# Altium schematic sheet InclinometerPower.SchDoc
size 420 x 297 mm; Address1: Address1; Address2: Address2; Address3: Address3; Address4: Address4; DocumentNumber: АБВГ.123456.001 Э3; SheetNumber: 1; Scale: 1:1; DocumentType: Схема электрическая принципиальная; FirstReferrence: АБВГ.123456.001
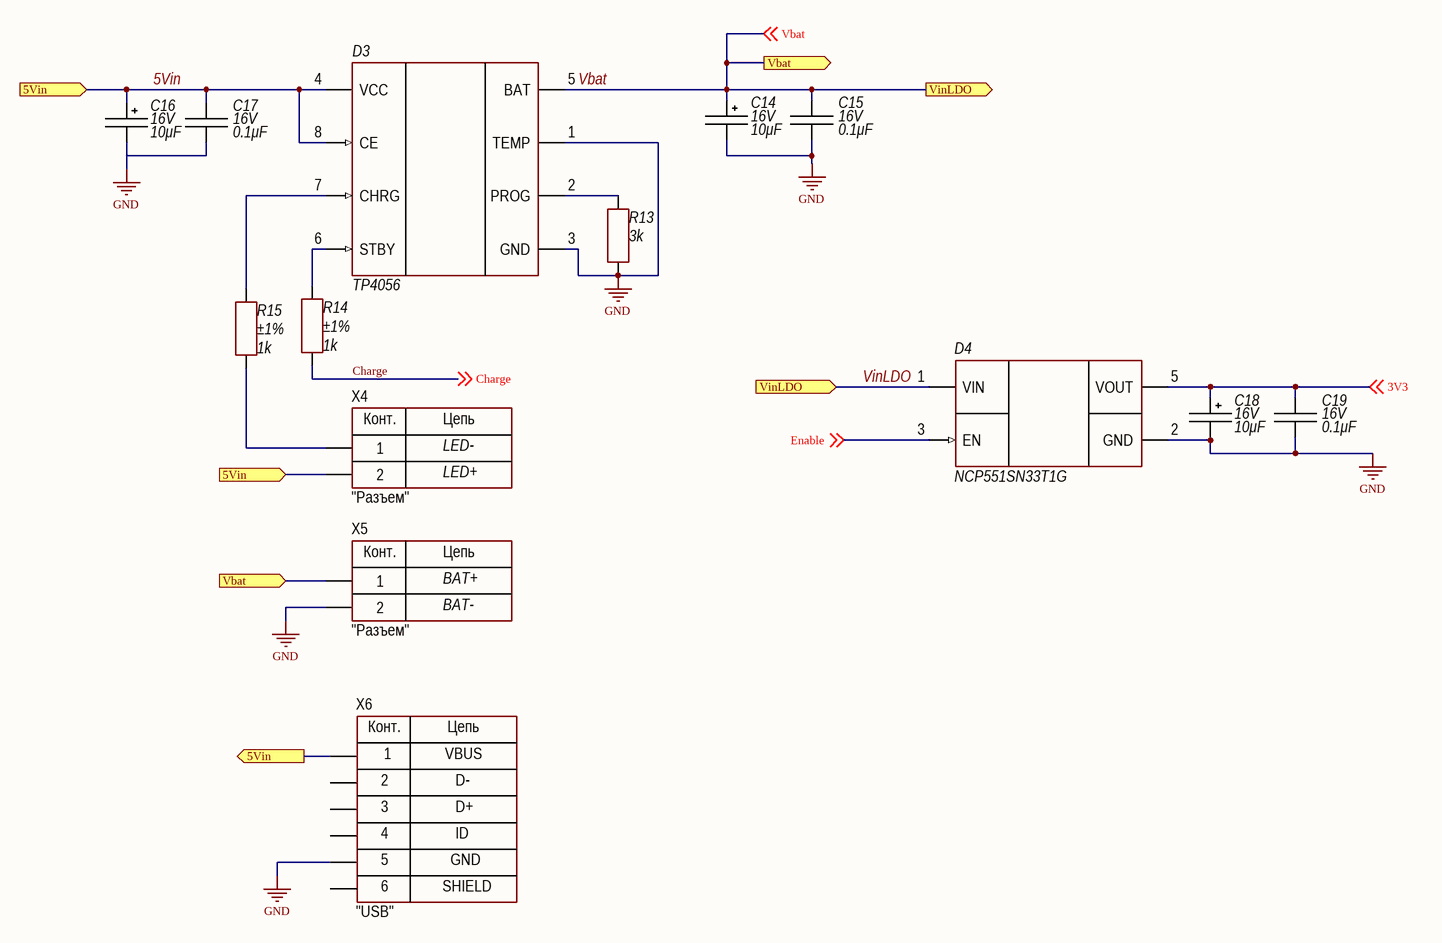
[diagram p0: InclinometerPower.SchDoc]

## Parts
C14  value 10μF  Voltage: 16V  [CAP: TANTAL-A]
C15  value 0.1μF  Voltage: 16V  [CAP: 0603]
C16  value 10μF  Voltage: 16V  [CAP: TANTAL-A]
C17  value 0.1μF  Voltage: 16V  [CAP: 0603]
C18  value 10μF  Voltage: 16V  [CAP: TANTAL-A]
C19  value 0.1μF  Voltage: 16V  [CAP: 0603]
D3  (no value)  [SOP8]
D4  (no value)  [5-TSOP]
R13  value 3k  [RES: 0603]
R14  value 1k  Tolerance: ±1%  [RES: 0603]  (hidden comment: Resistor film, 2k, ±1%, 0603, 0.1W, -55...+155°C)
R15  value 1k  Tolerance: ±1%  [RES: 0603]
X4  CommentText: "Разъем"  [CON: PLS-2]
X5  CommentText: "Разъем"  [CON: PLS-2]
X6  CommentText: "USB"  [CON: USB micro-A (ZX62-B-5PA)]

## Ports
5Vin (in), 5Vin (out), Vbat (in), Vbat (out), VinLDO (in), VinLDO (out)

## Nets
GND: C14.2 C15.1 C16.2 C17.1 C18.2 C19.1 D3.1(TEMP) D3.3(GND) D4.2(GND) R13.1 X5.2 X6.5
3V3: C18.1 C19.2 D4.5(VOUT) ; off-sheet 3V3
5Vin: C16.1 C17.2 D3.4(VCC) D3.8(CE) X4.2 X6.1 ; port 5Vin
Charge: R14.1 ; off-sheet Charge
Enable: D4.3(EN) ; off-sheet Enable
Vbat: C14.1 C15.2 D3.5(BAT) D4.1(VIN) X5.1 ; off-sheet Vbat, port VinLDO, port Vbat  [also labelled VinLDO]
NetD3_2: D3.2(PROG) R13.2
NetD3_6: D3.6(STBY) R14.2
NetD3_7: D3.7(CHRG) R15.2
NetR15_1: R15.1 X4.1

Not connected (* = marked no-connect by the designer): X6 0 2 3 4

## Notes on the sheet
- LED-
- LED+
- BAT+
- BAT-
- Перв. примен.
- Справ. №
- Подп. и дата
- Инв. № дубл.
- Взам. инв. №
- Разраб.
- Изм.
- Лист
- № докум.
- Подп.
- Дата
- Лит.
- Масса
- Масштаб
- Пров.
- Т.контр.
- Листов
- Инв. № подл.
- Утв.
- Н.контр.
- 2.106-A3
- Копировал
- Формат А3
- (in symbol Connector_USB_micro_B) Конт.; Цепь; VBUS; D-; D+; ID; GND; 6; SHIELD
- (in symbol PLS-2) Конт.; Цепь

## Library data of the parts
C14 C16 C18 = Tantal_A: Manufacturer: AVX; PartNumber: TAJA106K016RNJ; ValueManufacturerPartNumber: Tantalum capacitor, 10μF, 16V, ±10%, 3Ohm, case A (3216), -55...+125°C; Impedance: 3Ohm; Tolerance: ±10%; TypeCapacitor: Tantalum capacitor; Package: case A (3216); HelpURL: https://www.digikey.com/product-detail/en/avx-corporation/TAJA106K016RNJ/478-1655-1-ND/564687; Temperature: -55...+125°C
C15 C17 C19 = Ceramic_0603: Manufacturer: Murata Electronics; PartNumber: GRM188R71C104KA01D; ValueManufacturerPartNumber: Ceramic capacitor, 0.1μF, X7R, ±10%, 16V, 0603, -55...+125°C; TypeCapacitor: Ceramic capacitor; Tolerance: ±10%; TypeDielectric: X7R; Package: 0603; HelpURL: https://www.digikey.com/product-detail/en/murata-electronics/GRM188R71C104KA01D/490-1532-2-ND/587060; Temperature: -55...+125°C
D3 = TP4056: Linear Li-lon Battery Charger; Manufacturer: Top Power; CurrentOutput: 1A; ComponentType: Linear Li-lon Battery Charger; HelpURL: https://www.chipdip.ru/product/tp4056; Package: SOP-8; Temperature: -40...+85°C; ValueManufacturerPartNumber: =ComponentType+', '+VoltageInput+', '+MaxDropout+', '+VoltageOutput+', '+CurrentOutput+', '+Temperature+', '+Package; PartNumber: TP4056
D4 = NCP551SN33T1G: Linear voltage regulator; Manufacturer: ON Semiconductor; ValueManufacturerPartNumber: Linear voltage regulator, input 0...12V, 0.25V, output 3.3V, 150mA, -40...+85°C, TSOP-5; CurrentOutput: 150mA; MaxDropout: 0.25V; VoltageInput: input 0...12V; VoltageOutput: output 3.3V; ComponentType: Linear voltage regulator; HelpURL: https://www.digikey.com/en/products/detail/onsemi/NCP551SN33T1G/13511773; Package: TSOP-5; Temperature: -40...+85°C; PartNumber: NCP551SN33T1G
R13 = Resistor_0603: Manufacturer: Yageo; PartNumber: RC0603FR-073KL; ValueManufacturerPartNumber: Resistor film, 3k, ±1%, 0603, 0.1W, -55...+155°C; TypeResistor: Resistor film; Power: 0.1W; Tolerance: ±1%; Package: 0603; HelpURL: https://www.digikey.com/product-detail/en/yageo/RC0603FR-071KL/311-1-00KHRCT-ND/729790; Temperature: -55...+155°C
R14 = Resistor_0603: Manufacturer: Yageo; PartNumber: RC0603FR-071KL; ValueManufacturerPartNumber: Resistor film, 1k, ±1%, 0603, 0.1W, -55...+155°C; Package: 0603; HelpURL: https://www.digikey.com/product-detail/en/yageo/RC0603FR-071KL/311-1-00KHRCT-ND/729790; Temperature: -55...+155°C; TypeResistor: Resistor film; Power: 0.1W
R15 = Resistor_0603: Manufacturer: Yageo; PartNumber: RC0603FR-071KL; ValueManufacturerPartNumber: Resistor film, 1k, ±1%, 0603, 0.1W, -55...+155°C; TypeResistor: Resistor film; Power: 0.1W; Package: 0603; HelpURL: https://www.digikey.com/product-detail/en/yageo/RC0603FR-071KL/311-1-00KHRCT-ND/729790; Temperature: -55...+155°C
X4 X5 = PLS-2: Manufacturer: Connfly; ValueManufacturerPartNumber: Connector, 2pin, 2.54mm, 500VAC, 3A; TypeConnector: Connector; VoltageMax: 500VAC; Pitch: 2.54mm; CurrentMax: 3A; Multichannel: 2pin; HelpURL: https://www.chipdip.ru/product/pls-2; PartNumber: PLS-2
X6 = Connector_USB_micro_B: Manufacturer: Hirose Electric; ValueManufacturerPartNumber: USB micro B; PartNumber: ZX62-B-5PA; HelpURL: https://www.digikey.com/product-detail/en/hirose-electric-co-ltd/ZX62-B-5PA/H11579CT-ND/1851090; TypeConnector: USB micro B